# EAGLE design amc7135-24mm-RGBW-led-driver-with-butt-mk-1.2 (EAGLE 6.6.0)
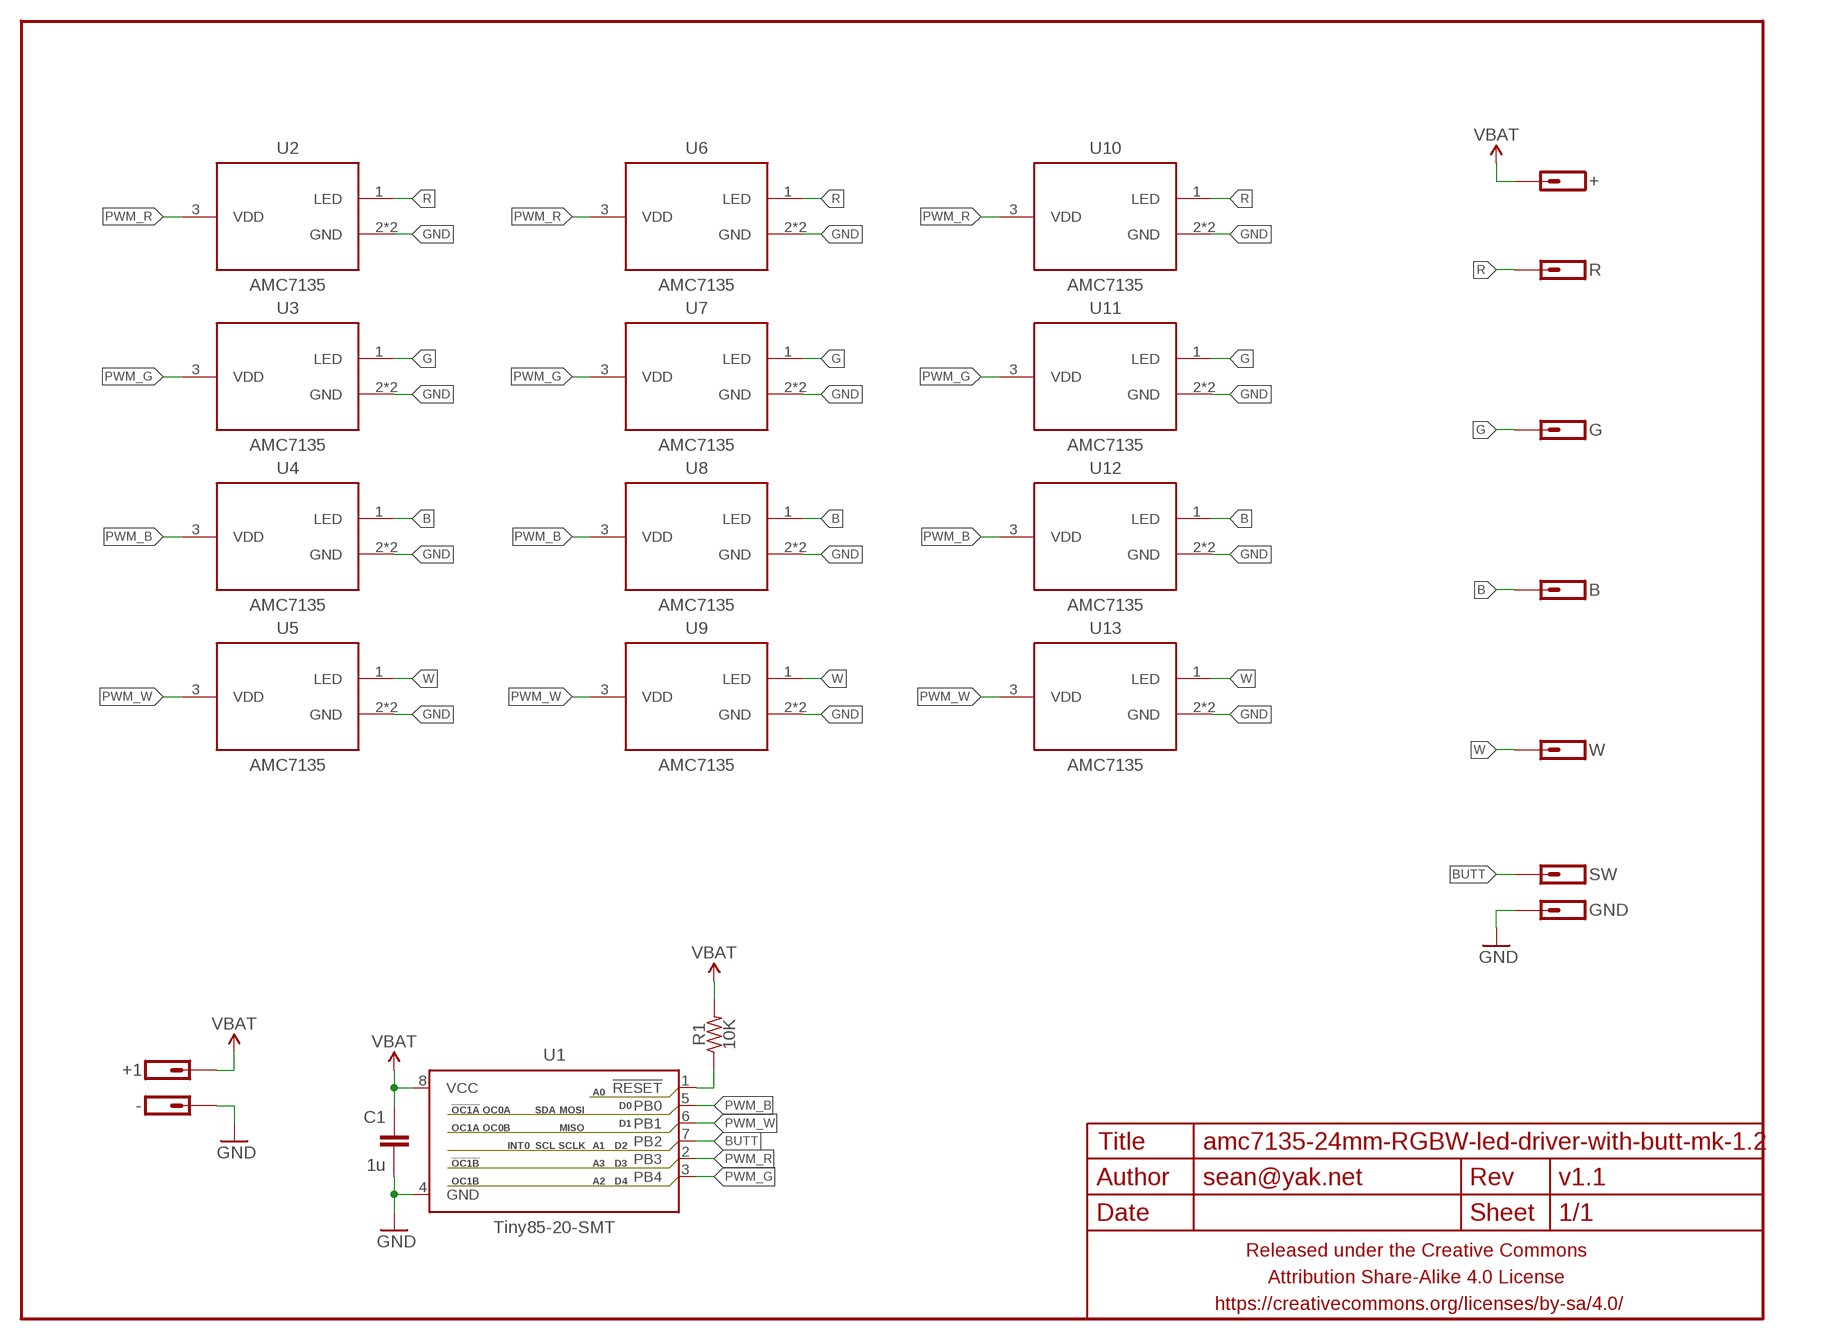
[diagram p0: schematic, sheet 1]

## Parts
+  M01PTH-1.2MM-NS  [1X01-1.2MM-NS]
+1  M01NOSTOP-CANTSTOP-DONTKNOWHOWTOSTOP  [1X01_SMD_NOSTOP_NOSILK]
-  M01NOT-A-VIA-NOPE  [1X01_NOSILK_NOSTOP]
B  M01SMD-1.25MM-DIA  [1X01-SMD-1.25MM-DIA-NS]
C1  1u  CAPACITOR-CERAMICC0603-TIGHTER  [C0603-TIGHTER]
FRAME1  FRAME-LETTERNO_PACKAGE  [DUMMY]
G  M01SMD-1.25MM-DIA  [1X01-SMD-1.25MM-DIA-NS]
GND  M01PTH-0.8MM  [1X01-0.8MM]
R  M01SMD-1.25MM-DIA  [1X01-SMD-1.25MM-DIA-NS]
R1  10K  RESISTORR0603-TIGHTER  [R0603-TIGHTER]
SW  M01PTH-0.8MM  [1X01-0.8MM]
U1  Tiny85-20-SMT  ATTINY45TINY85-20-SOICW  [SO08-EIAJ]
U2  AMC7135  AMC7135SOT-89  [SOT89]
U3  AMC7135  AMC7135SOT-89  [SOT89]
U4  AMC7135  AMC7135SOT-89  [SOT89]
U5  AMC7135  AMC7135SOT-89  [SOT89]
U6  AMC7135  AMC7135SOT-89  [SOT89]
U7  AMC7135  AMC7135SOT-89  [SOT89]
U8  AMC7135  AMC7135SOT-89  [SOT89]
U9  AMC7135  AMC7135SOT-89  [SOT89]
U10  AMC7135  AMC7135SOT-89  [SOT89]
U11  AMC7135  AMC7135SOT-89  [SOT89]
U12  AMC7135  AMC7135SOT-89  [SOT89]
U13  AMC7135  AMC7135SOT-89  [SOT89]
W  M01SMD-1.25MM-DIA  [1X01-SMD-1.25MM-DIA-NS]

## Nets
B: B.P$1 U8.1(LED)
BUTT: SW.1 U1.7(PB2)
G: G.P$1 U7.1(LED)
GND: -.P$1 C1.2 GND.1 U1.4(GND) U6.2(GND) U6.4(GND) U7.2(GND) U7.4(GND) U8.2(GND) U8.4(GND) U9.2(GND) U9.4(GND)
N$4: R1.1 U1.1(!RESET)
PWM_B: U1.5(PB0) U4.3(VDD) U8.3(VDD) U12.3(VDD)
PWM_G: U1.3(PB4) U3.3(VDD) U7.3(VDD) U11.3(VDD)
PWM_R: U1.2(PB3) U2.3(VDD) U6.3(VDD) U10.3(VDD)
PWM_W: U1.6(PB1) U5.3(VDD) U9.3(VDD) U13.3(VDD)
R: R.P$1 U6.1(LED)
VBAT: +1.1 +.P$1 C1.1 R1.2 U1.8(VCC)
W: U9.1(LED) W.P$1
Unconnected: U2.1(LED) U2.2(GND) U2.4(GND) U3.1(LED) U3.2(GND) U3.4(GND) U4.1(LED) U4.2(GND) U4.4(GND) U5.1(LED) U5.2(GND) U5.4(GND) U10.1(LED) U10.2(GND) U10.4(GND) U11.1(LED) U11.2(GND) U11.4(GND) U12.1(LED) U12.2(GND) U12.4(GND) U13.1(LED) U13.2(GND) U13.4(GND)

## Library data of the parts
+ +1 - B G GND R SW W = a_parts:M01: Header 1 Standard 1-pin 0.1" header. Use with straight break away headers (SKU : PRT-00116), right angle break away headers (PRT-00553), swiss pins (PRT-00743), machine pins (PRT-00117), and female headers (PRT-00115).
C1 = a_parts:CAPACITOR-CERAMIC: CAPACITOR, European symbol
FRAME1 = a_parts:FRAME-LETTER: Schematic Frame Standard 8.5x11 US Letter frame; DESIGNER: sean@yak.net; VERSION: v1.1
R1 = a_parts:RESISTOR: RESISTOR, American symbol
U1 = a_parts:ATTINY45: Atmel 8-pin 2/4/8kB flash uC; PROD_ID: IC-09092
U2-U13 = a_parts:AMC7135

## Board
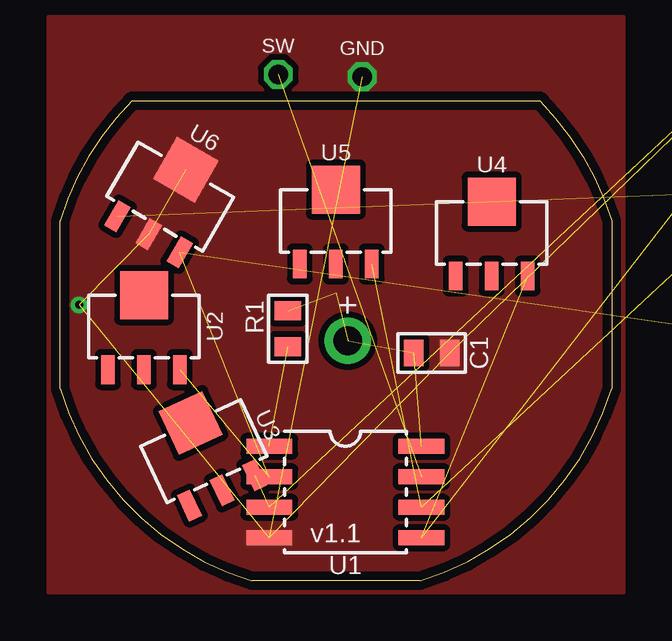
[diagram p1: board, top side]
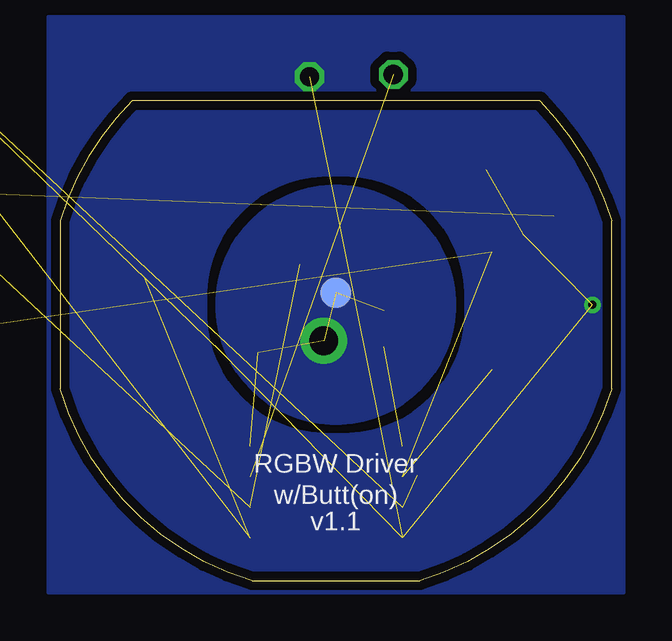
[diagram p2: board, bottom side, seen from below]

Size 23 x 20 mm. Coordinates in mm from the lower left corner, seen from the top.
Outline: 3,20 arc28 0,15 0,8 arc56 8,0 15,0 arc56 23,8 23,15 arc28 20,20 3,20
Copper layers (1*16): Top 0.0356mm / dielectric 1.5011mm / Bottom 0.0356mm
Design rules "LaenPCBOrder2": minimum track width 6mil, minimum drill 13mil, track to track 6mil, track to pad 6mil, pad to pad 6mil, via to via 6mil, smd to smd 6mil, copper to edge 15mil, drill to drill 6mil, minimum pad ring 7mil, minimum via ring 7mil, stop-mask expansion 3mil, vias tented up to drill 20mil, thermal gap 10mil

### Footprints (pad centres in the part's own frame; a part is rotated, then mirrored left to right if it is on the bottom)
1X01-1.2MM-NS = drill 1.2 pad 1.93: P$1 0,0
1X01_SMD_NOSTOP_NOSILK = smd 1.27 x 1.27: 1 0,0
1X01_NOSILK_NOSTOP = drill 0.33: P$1 0,0
1X01-SMD-1.25MM-DIA-NS = smd 1.25 x 1.25: P$1 0,0
C0603-TIGHTER = smd 0.8 x 1.1: 1 -0.75,0; 2 0.75,0
1X01-0.8MM = drill 0.8 octagon: 1 0,0
R0603-TIGHTER = smd 0.8 x 1.1: 1 -0.75,0; 2 0.75,0
SO08-EIAJ = smd 0.61 x 1.905: 1 -1.905,-3.175; 2 -0.635,-3.175; 3 0.635,-3.175; 4 1.905,-3.175; 5 1.905,3.175; 6 0.635,3.175; 7 -0.635,3.175; 8 -1.905,3.175
SOT89 = smd 0.58 x 1.2: 1 -1.5,-1.8; 2 0,-1.8; 3 1.5,-1.8 | smd 2 x 2: 4 0,1.3

### Placement (x,y rotation side)
+  12,10 90 top
+1  11.5,12 0 bottom
-  0.8,11.5 90 bottom
B  27.9,19.3 0 top  (outside the outline)
C1  15.5,9.5 0 top
FRAME1  -0.5,-0.5 0 top
G  30,19.3 0 top  (outside the outline)
GND  12.6,21 0 top
R  27.9,16.2 0 top  (outside the outline)
R1  9.5,10.5 90 top
SW  9.1,21.1 0 top
U1  11.9,3.7 270 top
U2  3.5,10.6 0 top
U3  6,5.4 25 top
U4  18,14.5 0 top
U5  11.5,15 0 top
U6  4.6,16 330 top
U7  34.1,29.9 0 top  (outside the outline)
U8  29.3,23.9 0 top  (outside the outline)
U9  34.1,23.9 0 top  (outside the outline)
U10  28.9,11.8 0 top  (outside the outline)
U11  33.7,11.8 0 top  (outside the outline)
U12  28.9,5.8 0 top  (outside the outline)
U13  33.7,5.8 0 top  (outside the outline)
W  30,16.2 0 top  (outside the outline)

### Tracks (layer width: path | path; a pad name or v marks a point on that pad's centre or on a via)
B  (1 unrouted)
BUTT  (1 unrouted)
G  (1 unrouted)
GND  (11 unrouted)
  pour Top (isolate 0.25, rank 6, no thermals): -0.5,-0.5 23.5,-0.5 23.5,23.5 -0.5,23.5
  pour Bottom (isolate 0.35, rank 6, no thermals): -0.5,-0.5 -0.5,23.5 23.5,23.5 23.5,-0.5
N$4  (1 unrouted)
PWM_B  (3 unrouted)
PWM_G  (3 unrouted)
PWM_R  (3 unrouted)
PWM_W  (3 unrouted)
R  (1 unrouted)
VBAT  (4 unrouted)
  pour Bottom (isolate 0.305, no thermals): 8,15 arc-90 15,15 arc-90 15,8 arc-90 8,8 arc-90
W  (1 unrouted)

### Text on the board
bPlace: RGBW Driver | w/Butt(on)